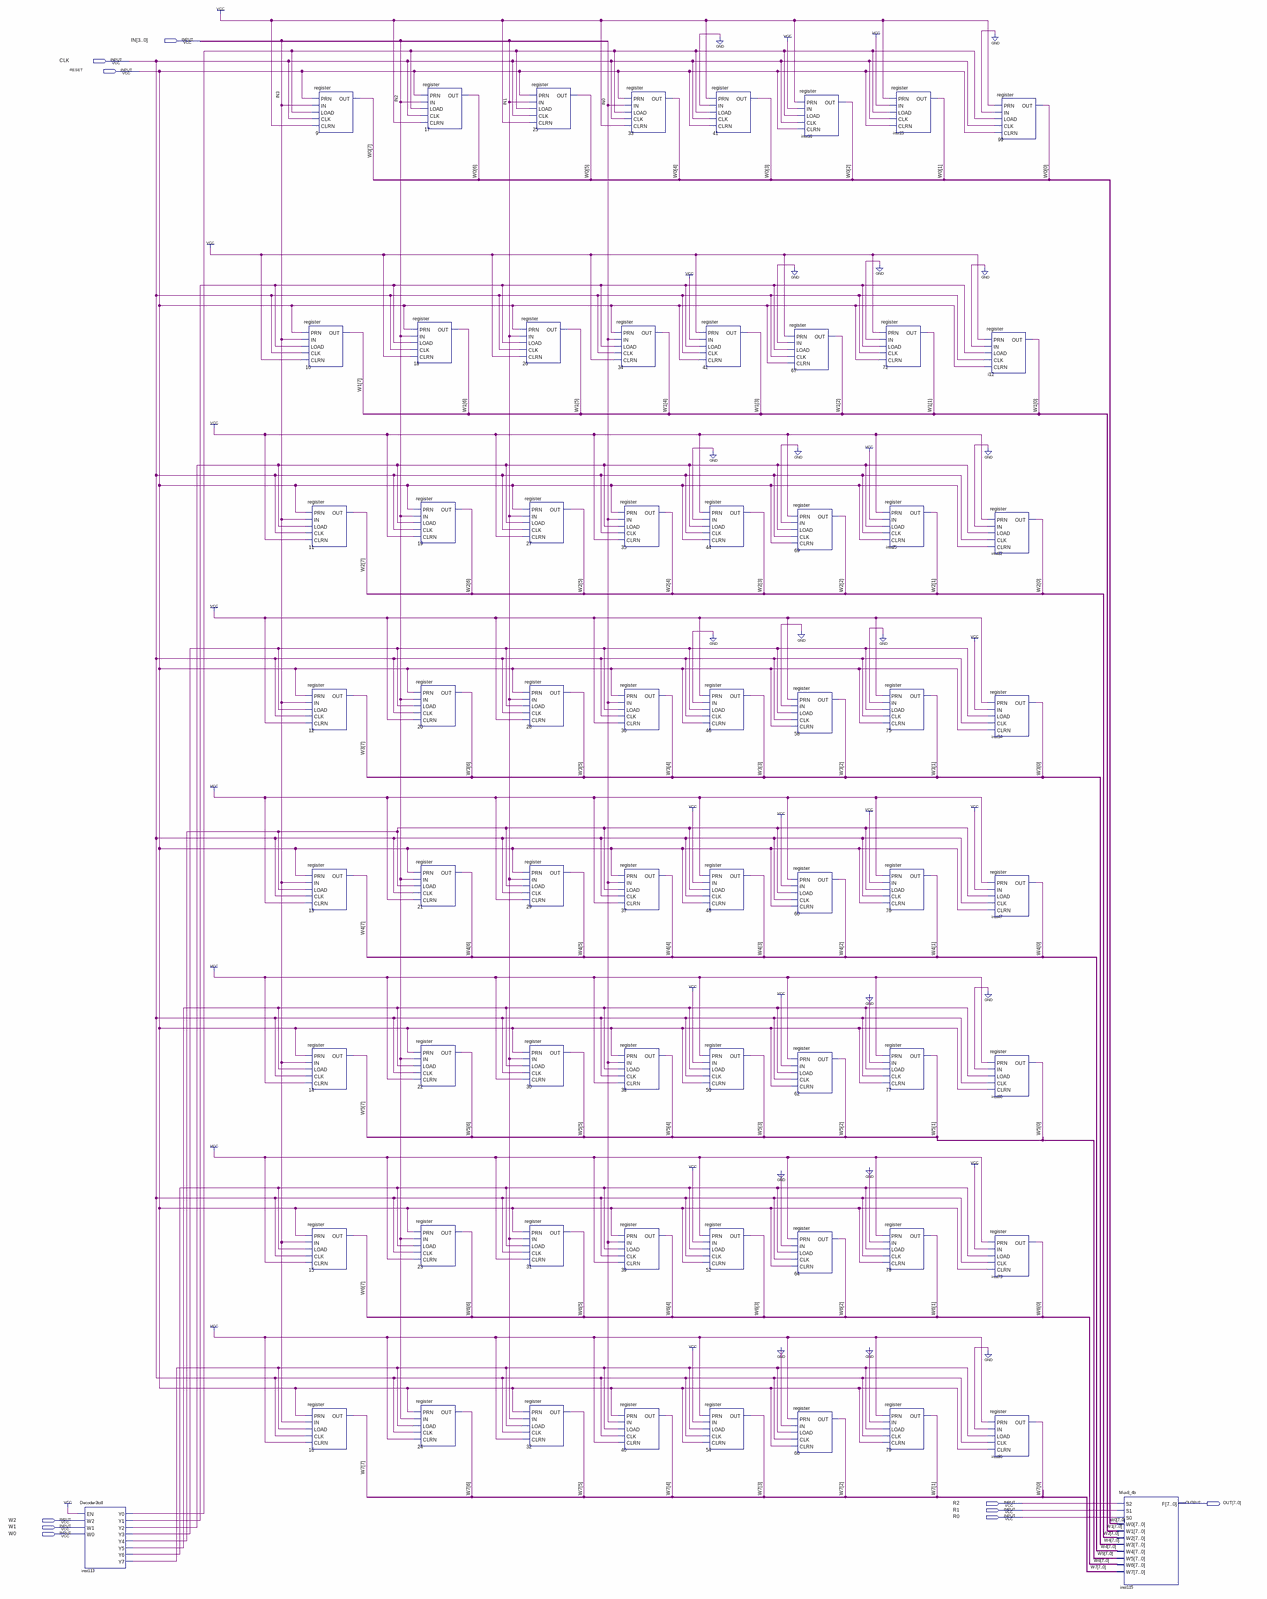
[diagram p0: schematic sheet, whole]
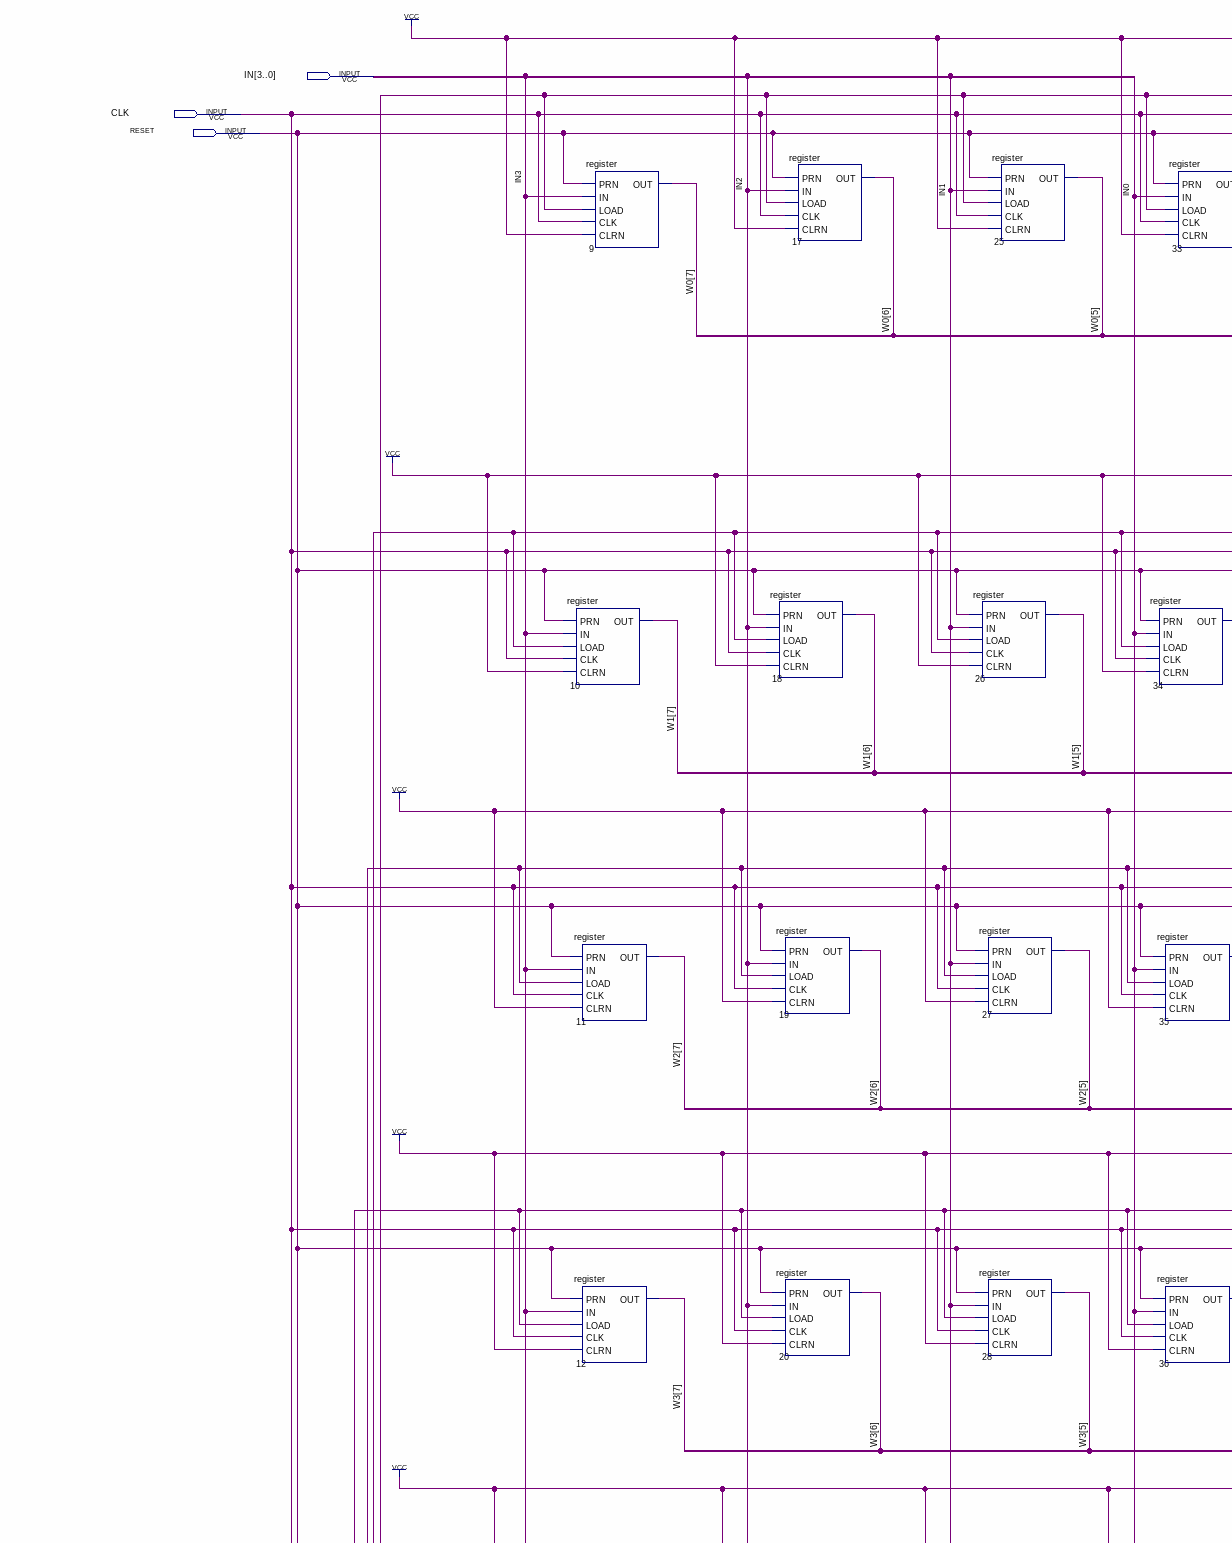
[diagram p1: schematic sheet, upper left part]
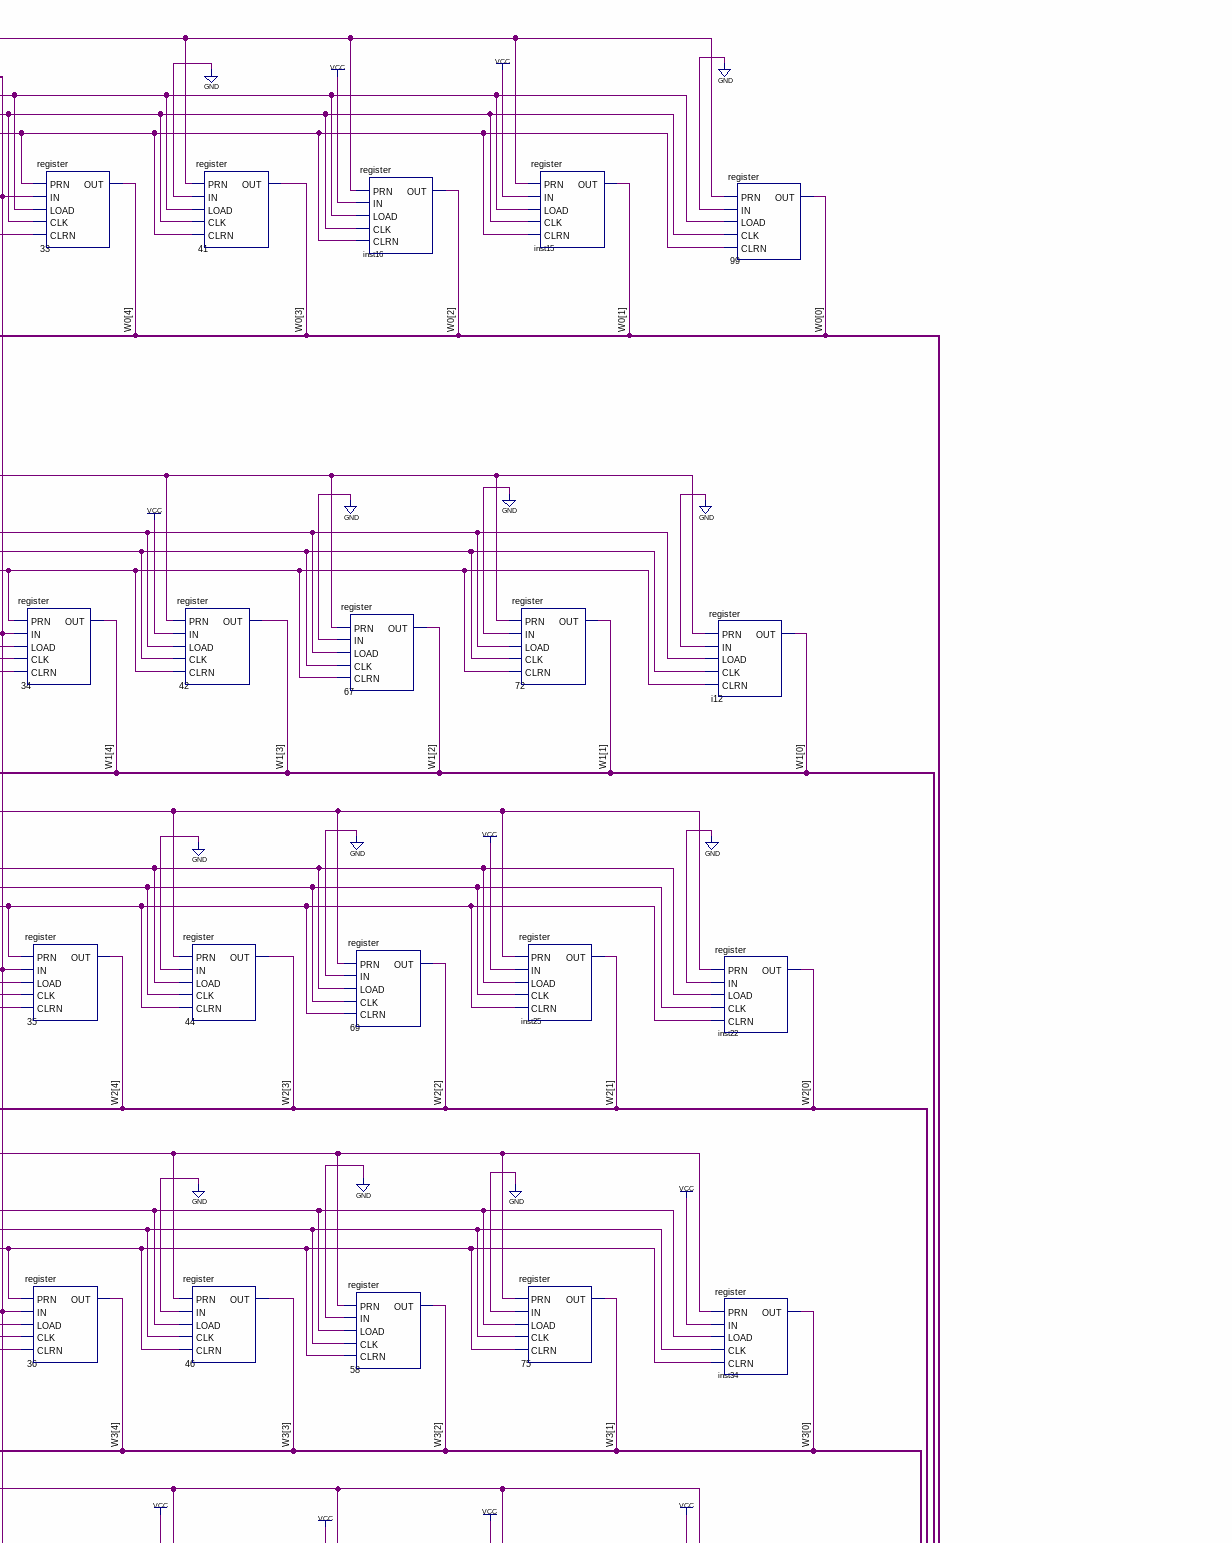
[diagram p2: schematic sheet, upper right part]
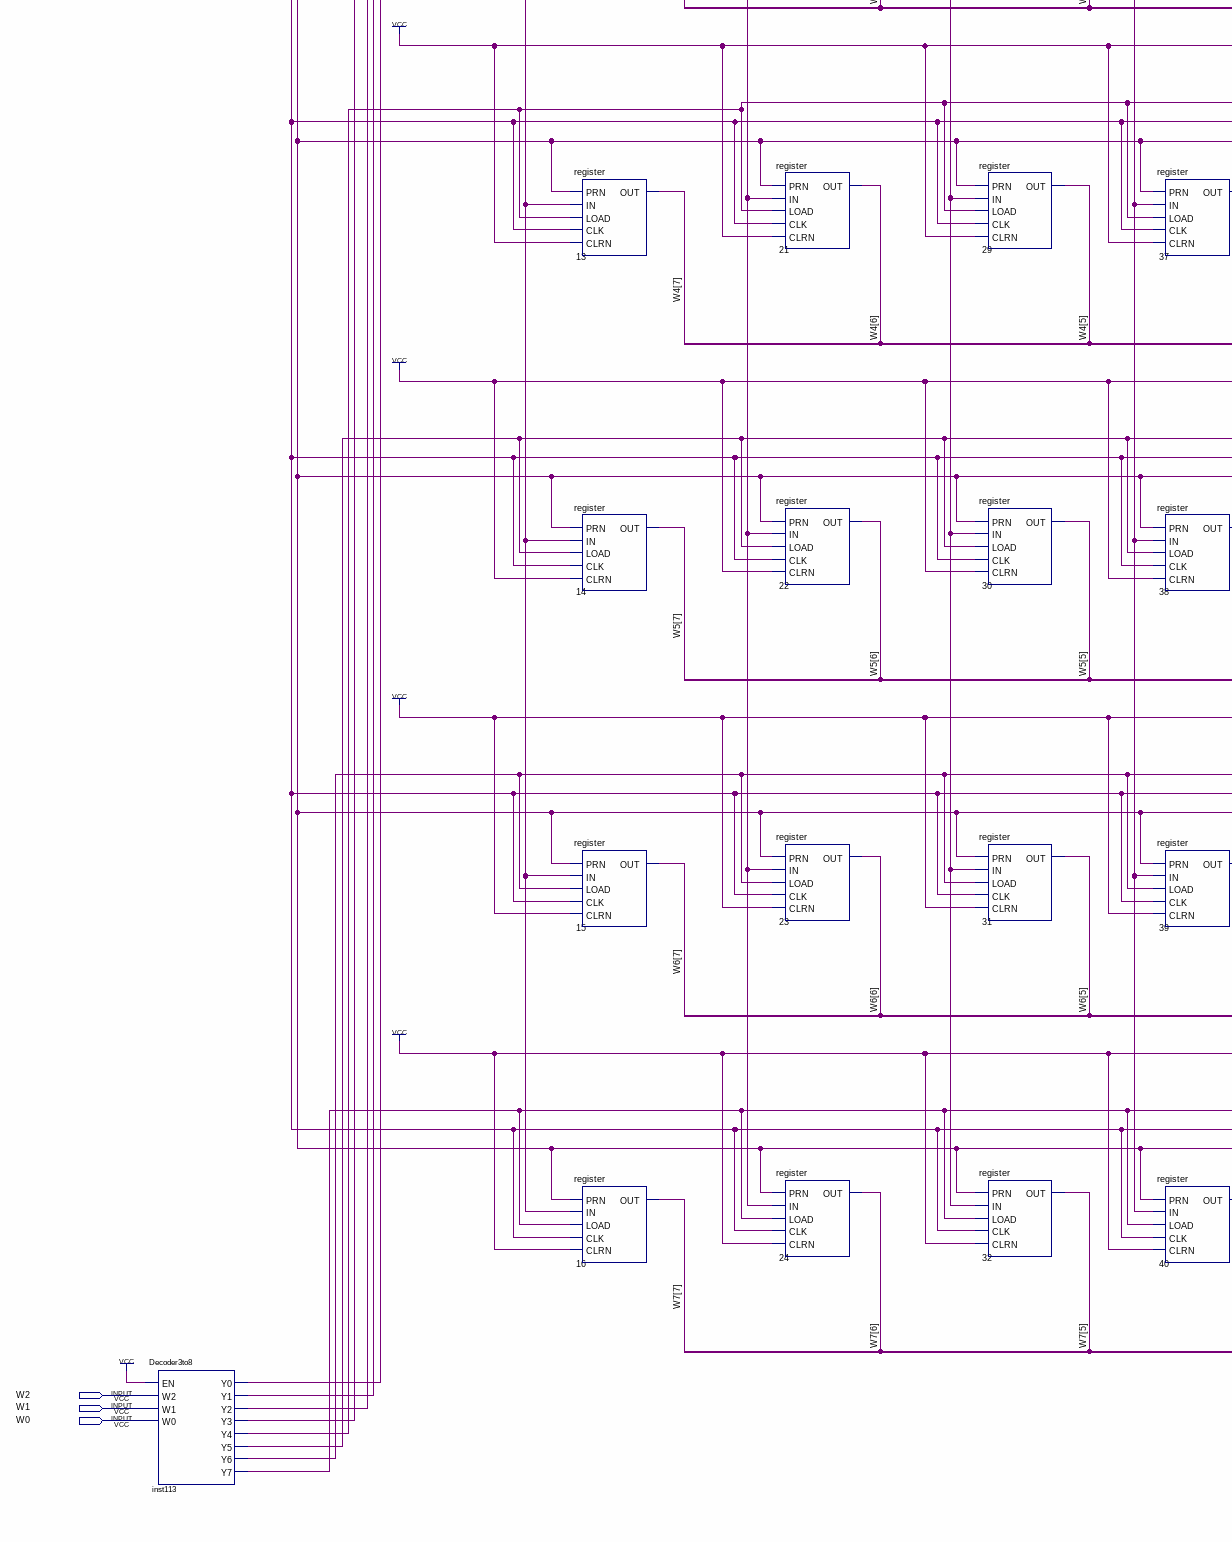
[diagram p3: schematic sheet, lower left part]
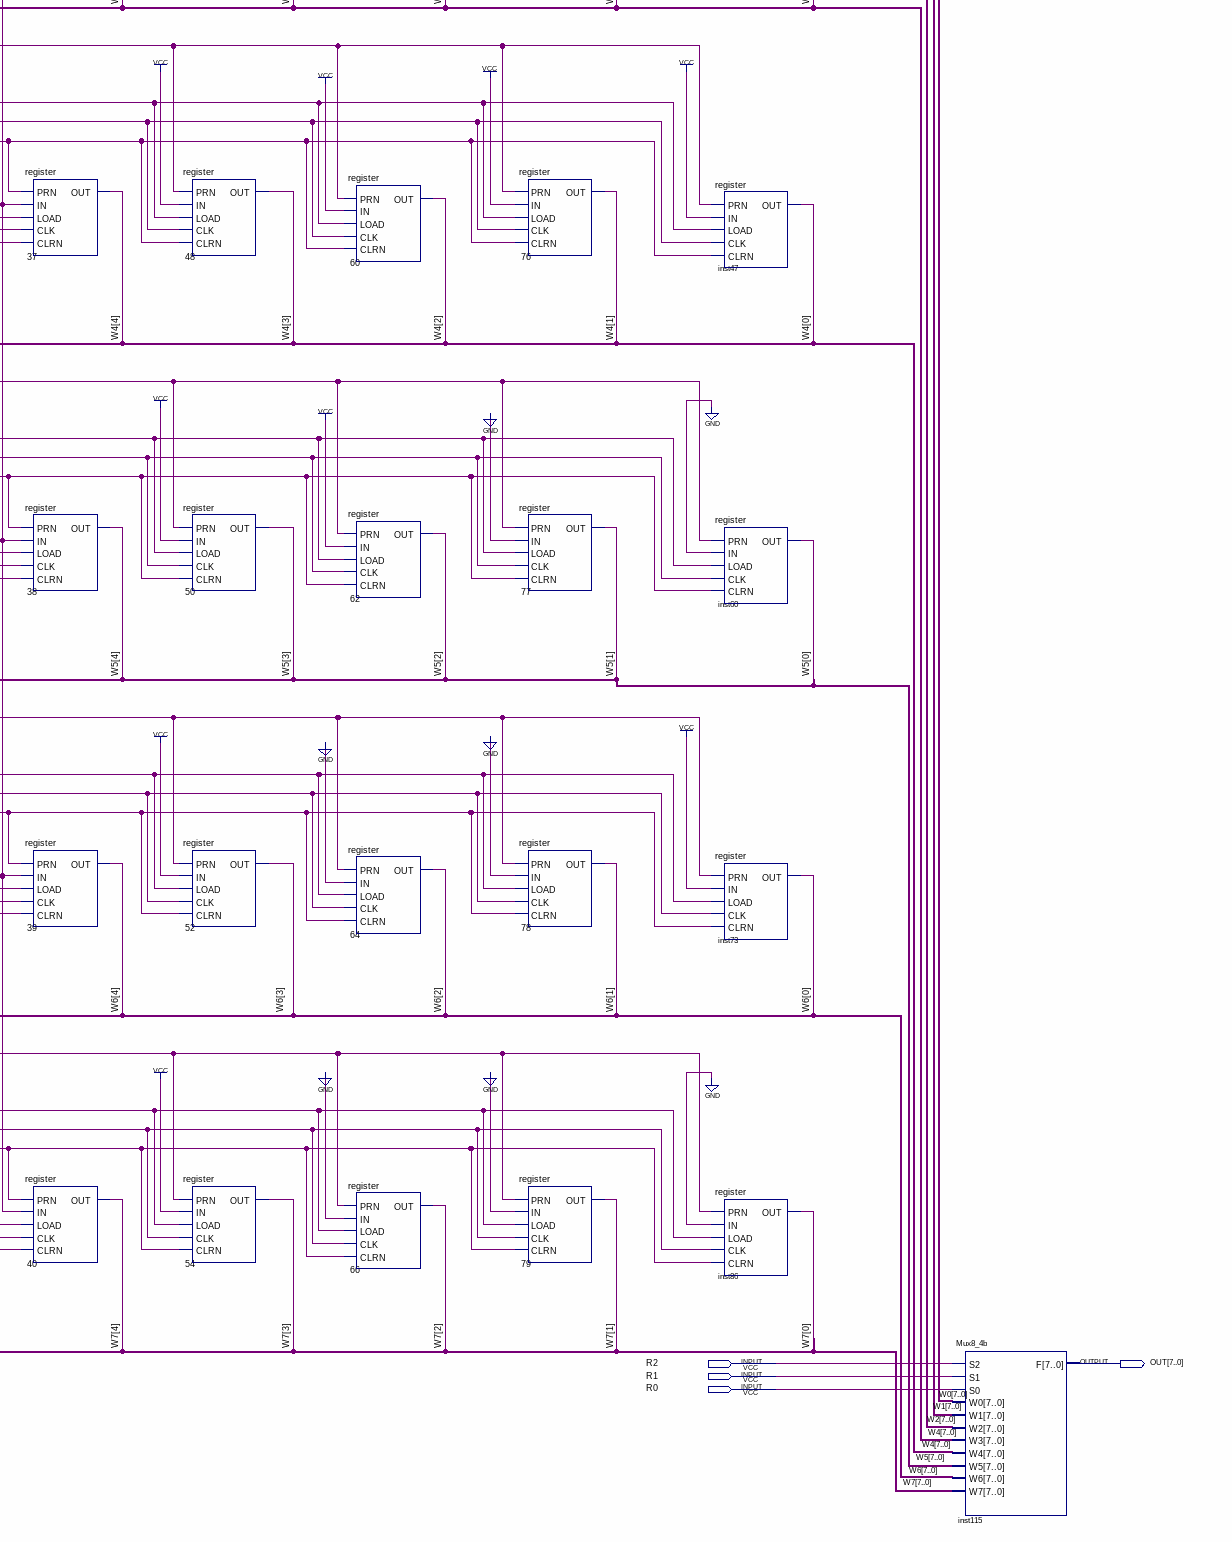
[diagram p4: schematic sheet, lower right part]
// Quartus schematic regfile.bdf as structural Verilog: 66 symbols, 10 pins
module regfile (
  input  [3:0] IN,
  input  CLK,
  input  RESET,
  input  R2,
  input  R1,
  input  R0,
  input  W2,
  input  W1,
  input  W0,
  output [7:0] OUT
);

  wire inst113_y0, inst113_y1, inst113_y2, inst113_y3, inst113_y4, inst113_y5, inst113_y6, inst113_y7;
  wire [7:0] W0_bus, W1_bus, W2_bus, W3, W4, W5, W6, W7;

  Decoder3to8 inst113 (
    .EN(1'b1), .W2(W2), .W1(W1), .W0(W0), .Y0(inst113_y0), .Y1(inst113_y1), .Y2(inst113_y2), .Y3(inst113_y3),
    .Y4(inst113_y4), .Y5(inst113_y5), .Y6(inst113_y6), .Y7(inst113_y7));
  register u_9 (.PRN(RESET), .IN(IN[3]), .LOAD(inst113_y0), .CLK(CLK), .CLRN(1'b1), .OUT(W0_bus[7]));
  register u_10 (.PRN(RESET), .IN(IN[3]), .LOAD(inst113_y1), .CLK(CLK), .CLRN(1'b1), .OUT(W1_bus[7]));
  register u_11 (.PRN(RESET), .IN(IN[3]), .LOAD(inst113_y2), .CLK(CLK), .CLRN(1'b1), .OUT(W2_bus[7]));
  register u_12 (.PRN(RESET), .IN(IN[3]), .LOAD(inst113_y3), .CLK(CLK), .CLRN(1'b1), .OUT(W3[7]));
  register u_13 (.PRN(RESET), .IN(IN[3]), .LOAD(inst113_y4), .CLK(CLK), .CLRN(1'b1), .OUT(W4[7]));
  register u_14 (.PRN(RESET), .IN(IN[3]), .LOAD(inst113_y5), .CLK(CLK), .CLRN(1'b1), .OUT(W5[7]));
  register u_15 (.PRN(RESET), .IN(IN[3]), .LOAD(inst113_y6), .CLK(CLK), .CLRN(1'b1), .OUT(W6[7]));
  register u_16 (.PRN(RESET), .IN(IN[3]), .LOAD(inst113_y7), .CLK(CLK), .CLRN(1'b1), .OUT(W7[7]));
  register u_17 (.PRN(RESET), .IN(IN[2]), .LOAD(inst113_y0), .CLK(CLK), .CLRN(1'b1), .OUT(W0_bus[6]));
  register u_18 (.PRN(RESET), .IN(IN[2]), .LOAD(inst113_y1), .CLK(CLK), .CLRN(1'b1), .OUT(W1_bus[6]));
  register u_19 (.PRN(RESET), .IN(IN[2]), .LOAD(inst113_y2), .CLK(CLK), .CLRN(1'b1), .OUT(W2_bus[6]));
  register u_20 (.PRN(RESET), .IN(IN[2]), .LOAD(inst113_y3), .CLK(CLK), .CLRN(1'b1), .OUT(W3[6]));
  register u_21 (.PRN(RESET), .IN(IN[2]), .LOAD(inst113_y4), .CLK(CLK), .CLRN(1'b1), .OUT(W4[6]));
  register u_22 (.PRN(RESET), .IN(IN[2]), .LOAD(inst113_y5), .CLK(CLK), .CLRN(1'b1), .OUT(W5[6]));
  register u_23 (.PRN(RESET), .IN(IN[2]), .LOAD(inst113_y6), .CLK(CLK), .CLRN(1'b1), .OUT(W6[6]));
  register u_24 (.PRN(RESET), .IN(IN[2]), .LOAD(inst113_y7), .CLK(CLK), .CLRN(1'b1), .OUT(W7[6]));
  register u_25 (.PRN(RESET), .IN(IN[1]), .LOAD(inst113_y0), .CLK(CLK), .CLRN(1'b1), .OUT(W0_bus[5]));
  register u_26 (.PRN(RESET), .IN(IN[1]), .LOAD(inst113_y1), .CLK(CLK), .CLRN(1'b1), .OUT(W1_bus[5]));
  register u_27 (.PRN(RESET), .IN(IN[1]), .LOAD(inst113_y2), .CLK(CLK), .CLRN(1'b1), .OUT(W2_bus[5]));
  register u_28 (.PRN(RESET), .IN(IN[1]), .LOAD(inst113_y3), .CLK(CLK), .CLRN(1'b1), .OUT(W3[5]));
  register u_29 (.PRN(RESET), .IN(IN[1]), .LOAD(inst113_y4), .CLK(CLK), .CLRN(1'b1), .OUT(W4[5]));
  register u_30 (.PRN(RESET), .IN(IN[1]), .LOAD(inst113_y5), .CLK(CLK), .CLRN(1'b1), .OUT(W5[5]));
  register u_31 (.PRN(RESET), .IN(IN[1]), .LOAD(inst113_y6), .CLK(CLK), .CLRN(1'b1), .OUT(W6[5]));
  register u_32 (.PRN(RESET), .IN(IN[1]), .LOAD(inst113_y7), .CLK(CLK), .CLRN(1'b1), .OUT(W7[5]));
  register u_33 (.PRN(RESET), .IN(IN[0]), .LOAD(inst113_y0), .CLK(CLK), .CLRN(1'b1), .OUT(W0_bus[4]));
  register u_34 (.PRN(RESET), .IN(IN[0]), .LOAD(inst113_y1), .CLK(CLK), .CLRN(1'b1), .OUT(W1_bus[4]));
  register u_35 (.PRN(RESET), .IN(IN[0]), .LOAD(inst113_y2), .CLK(CLK), .CLRN(1'b1), .OUT(W2_bus[4]));
  register u_36 (.PRN(RESET), .IN(IN[0]), .LOAD(inst113_y3), .CLK(CLK), .CLRN(1'b1), .OUT(W3[4]));
  register u_37 (.PRN(RESET), .IN(IN[0]), .LOAD(inst113_y4), .CLK(CLK), .CLRN(1'b1), .OUT(W4[4]));
  register u_38 (.PRN(RESET), .IN(IN[0]), .LOAD(inst113_y5), .CLK(CLK), .CLRN(1'b1), .OUT(W5[4]));
  register u_39 (.PRN(RESET), .IN(IN[0]), .LOAD(inst113_y6), .CLK(CLK), .CLRN(1'b1), .OUT(W6[4]));
  register u_40 (.PRN(RESET), .IN(IN[0]), .LOAD(inst113_y7), .CLK(CLK), .CLRN(1'b1), .OUT(W7[4]));
  register u_41 (.PRN(1'b1), .IN(1'b0), .LOAD(inst113_y0), .CLK(CLK), .CLRN(RESET), .OUT(W0_bus[3]));
  register u_42 (.PRN(1'b1), .IN(1'b1), .LOAD(inst113_y1), .CLK(CLK), .CLRN(RESET), .OUT(W1_bus[3]));
  register u_44 (.PRN(1'b1), .IN(1'b0), .LOAD(inst113_y2), .CLK(CLK), .CLRN(RESET), .OUT(W2_bus[3]));
  register u_46 (.PRN(1'b1), .IN(1'b0), .LOAD(inst113_y3), .CLK(CLK), .CLRN(RESET), .OUT(W3[3]));
  register u_48 (.PRN(1'b1), .IN(1'b1), .LOAD(inst113_y4), .CLK(CLK), .CLRN(RESET), .OUT(W4[3]));
  register u_50 (.PRN(1'b1), .IN(1'b1), .LOAD(inst113_y5), .CLK(CLK), .CLRN(RESET), .OUT(W5[3]));
  register u_52 (.PRN(1'b1), .IN(1'b1), .LOAD(inst113_y6), .CLK(CLK), .CLRN(RESET), .OUT(W6[3]));
  register u_54 (.PRN(1'b1), .IN(1'b1), .LOAD(inst113_y7), .CLK(CLK), .CLRN(RESET), .OUT(W7[3]));
  register inst16 (.PRN(1'b1), .IN(1'b1), .LOAD(inst113_y0), .CLK(CLK), .CLRN(RESET), .OUT(W0_bus[2]));
  register u_67 (.PRN(1'b1), .IN(1'b0), .LOAD(inst113_y1), .CLK(CLK), .CLRN(RESET), .OUT(W1_bus[2]));
  register u_69 (.PRN(1'b1), .IN(1'b0), .LOAD(inst113_y2), .CLK(CLK), .CLRN(RESET), .OUT(W2_bus[2]));
  register u_58 (.PRN(1'b1), .IN(1'b0), .LOAD(inst113_y3), .CLK(CLK), .CLRN(RESET), .OUT(W3[2]));
  register u_60 (.PRN(1'b1), .IN(1'b1), .LOAD(inst113_y4), .CLK(CLK), .CLRN(RESET), .OUT(W4[2]));
  register u_62 (.PRN(1'b1), .IN(1'b1), .LOAD(inst113_y5), .CLK(CLK), .CLRN(RESET), .OUT(W5[2]));
  register u_64 (.PRN(1'b1), .IN(1'b0), .LOAD(inst113_y6), .CLK(CLK), .CLRN(RESET), .OUT(W6[2]));
  register u_66 (.PRN(1'b1), .IN(1'b0), .LOAD(inst113_y7), .CLK(CLK), .CLRN(RESET), .OUT(W7[2]));
  register u_72 (.PRN(1'b1), .IN(1'b0), .LOAD(inst113_y1), .CLK(CLK), .CLRN(RESET), .OUT(W1_bus[1]));
  register inst25 (.PRN(1'b1), .IN(1'b1), .LOAD(inst113_y2), .CLK(CLK), .CLRN(RESET), .OUT(W2_bus[1]));
  register u_75 (.PRN(1'b1), .IN(1'b0), .LOAD(inst113_y3), .CLK(CLK), .CLRN(RESET), .OUT(W3[1]));
  register u_76 (.PRN(1'b1), .IN(1'b1), .LOAD(inst113_y4), .CLK(CLK), .CLRN(RESET), .OUT(W4[1]));
  register u_77 (.PRN(1'b1), .IN(1'b0), .LOAD(inst113_y5), .CLK(CLK), .CLRN(RESET), .OUT(W5[1]));
  register u_78 (.PRN(1'b1), .IN(1'b0), .LOAD(inst113_y6), .CLK(CLK), .CLRN(RESET), .OUT(W6[1]));
  register u_79 (.PRN(1'b1), .IN(1'b0), .LOAD(inst113_y7), .CLK(CLK), .CLRN(RESET), .OUT(W7[1]));
  register inst15 (.PRN(1'b1), .IN(1'b1), .LOAD(inst113_y0), .CLK(CLK), .CLRN(RESET), .OUT(W0_bus[1]));
  register i12 (.PRN(1'b1), .IN(1'b0), .LOAD(inst113_y1), .CLK(CLK), .CLRN(RESET), .OUT(W1_bus[0]));
  register inst22 (.PRN(1'b1), .IN(1'b0), .LOAD(inst113_y2), .CLK(CLK), .CLRN(RESET), .OUT(W2_bus[0]));
  register inst34 (.PRN(1'b1), .IN(1'b1), .LOAD(inst113_y3), .CLK(CLK), .CLRN(RESET), .OUT(W3[0]));
  register inst47 (.PRN(1'b1), .IN(1'b1), .LOAD(inst113_y4), .CLK(CLK), .CLRN(RESET), .OUT(W4[0]));
  register inst60 (.PRN(1'b1), .IN(1'b0), .LOAD(inst113_y5), .CLK(CLK), .CLRN(RESET), .OUT(W5[0]));
  register inst73 (.PRN(1'b1), .IN(1'b1), .LOAD(inst113_y6), .CLK(CLK), .CLRN(RESET), .OUT(W6[0]));
  register inst86 (.PRN(1'b1), .IN(1'b0), .LOAD(inst113_y7), .CLK(CLK), .CLRN(RESET), .OUT(W7[0]));
  register u_99 (.PRN(1'b1), .IN(1'b0), .LOAD(inst113_y0), .CLK(CLK), .CLRN(RESET), .OUT(W0_bus[0]));
  Mux8_4b inst115 (
    .S2(R2), .S1(R1), .S0(R0), .W0(W0_bus), .W1(W1_bus), .W2(W2_bus), .W3(W4), .W4(W4), .W5(W5), .W6(W6),
    .W7(W7), .F(OUT));
endmodule
